# EAGLE schematic FPGA_board-v1 (EAGLE 9.5.2)
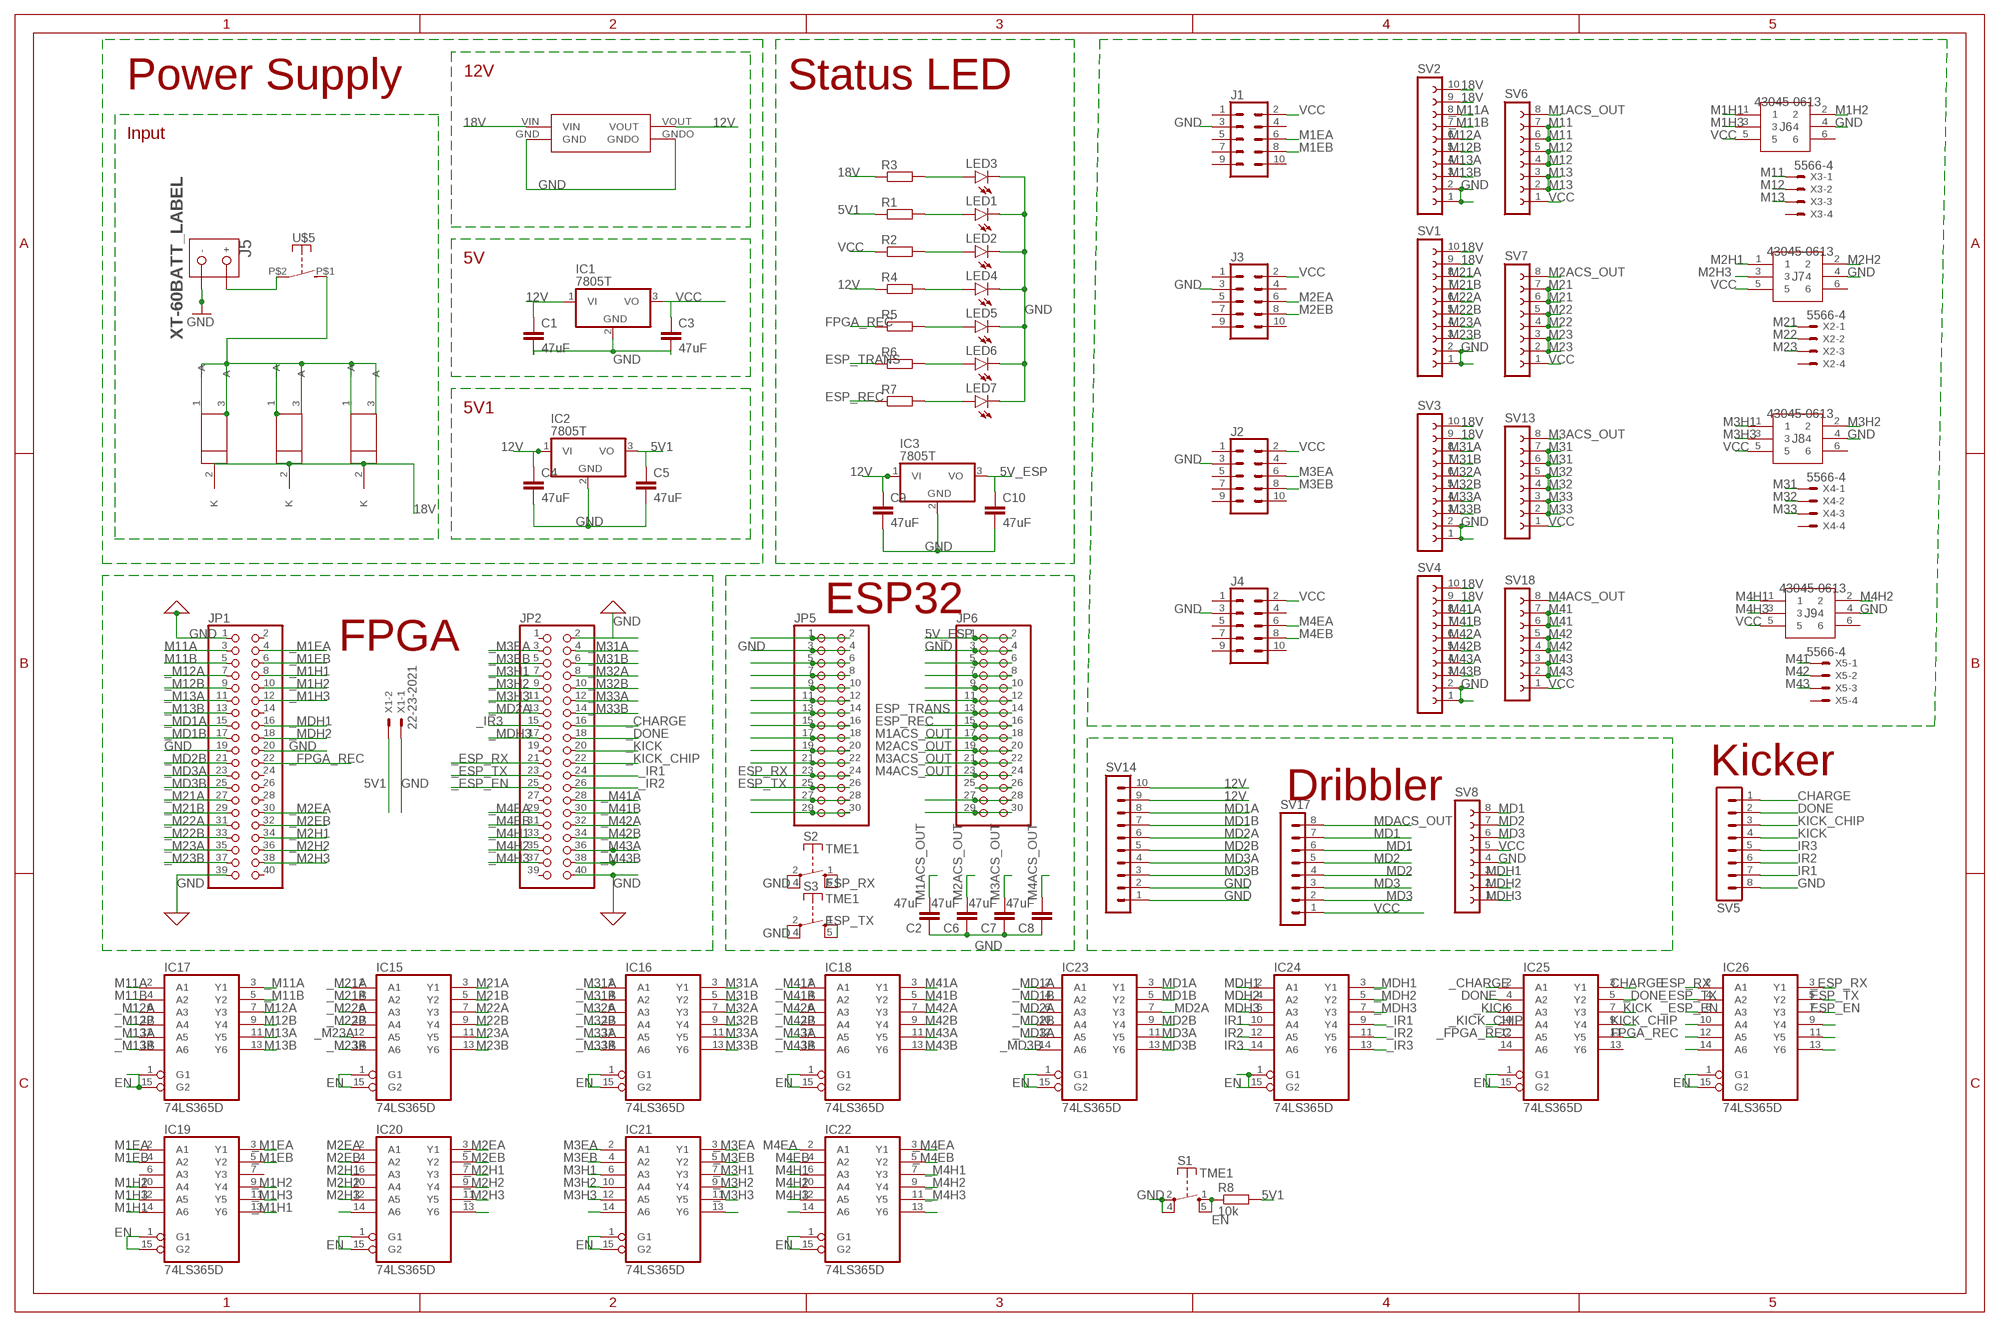
[diagram p0: schematic, sheet 1]

## Parts
C1  47uF  C-EUC1206  [C1206]
C2  47uF  C-EUC1206  [C1206]
C3  47uF  C-EUC1206  [C1206]
C4  47uF  C-EUC1206  [C1206]
C5  47uF  C-EUC1206  [C1206]
C6  47uF  C-EUC1206  [C1206]
C7  47uF  C-EUC1206  [C1206]
C8  47uF  C-EUC1206  [C1206]
C9  47uF  C-EUC1206  [C1206]
C10  47uF  C-EUC1206  [C1206]
IC1  7805T  [TO220H]
IC2  7805T  [TO220H]
IC3  7805T  [TO220H]
IC15  74LS365D  [SO16]
IC16  74LS365D  [SO16]
IC17  74LS365D  [SO16]
IC18  74LS365D  [SO16]
IC19  74LS365D  [SO16]
IC20  74LS365D  [SO16]
IC21  74LS365D  [SO16]
IC22  74LS365D  [SO16]
IC23  74LS365D  [SO16]
IC24  74LS365D  [SO16]
IC25  74LS365D  [SO16]
IC26  74LS365D  [SO16]
J1  CONN_05X2SHD_LOCK  [2X5-SHROUDED_LOCK]
J2  CONN_05X2SHD_LOCK  [2X5-SHROUDED_LOCK]
J3  CONN_05X2SHD_LOCK  [2X5-SHROUDED_LOCK]
J4  CONN_05X2SHD_LOCK  [2X5-SHROUDED_LOCK]
J5  XT-60BATT_LABEL  [XT-60]
J6  43045-0613  [43045-0613]
J7  43045-0613  [43045-0613]
J8  43045-0613  [43045-0613]
J9  43045-0613  [43045-0613]
JP1  PINHD-2X20  [2X20]
JP2  PINHD-2X20  [2X20]
JP5  PINHD-2X15  [2X15]
JP6  PINHD-2X15  [2X15]
LED1  LEDSMT1206  [1206]
LED2  LEDSMT1206  [1206]
LED3  LEDSMT1206  [1206]
LED4  LEDSMT1206  [1206]
LED5  LEDSMT1206  [1206]
LED6  LEDSMT1206  [1206]
LED7  LEDSMT1206  [1206]
R1  R-EU_R1206  [R1206]
R2  R-EU_R1206  [R1206]
R3  R-EU_R1206  [R1206]
R4  R-EU_R1206  [R1206]
R5  R-EU_R1206  [R1206]
R6  R-EU_R1206  [R1206]
R7  R-EU_R1206  [R1206]
R8  10k  R-EU_0204/7  [0204/7]
S1  TME1  [TME1]
S2  TME1  [TME1]
S3  TME1  [TME1]
SV1  FE10-1  [FE10]
SV2  FE10-1  [FE10]
SV3  FE10-1  [FE10]
SV4  FE10-1  [FE10]
SV5  MA08-1  [MA08-1]
SV6  FE08-1  [FE08]
SV7  FE08-1  [FE08]
SV8  FE08-1  [FE08]
SV13  FE08-1  [FE08]
SV14  MA10-1  [MA10-1]
SV17  MA08-1  [MA08-1]
SV18  FE08-1  [FE08]
U1  LP38690DT-3.3  [TO228P1042X238-3N]
U2  LP38690DT-3.3  [TO228P1042X238-3N]
U3  LP38690DT-3.3  [TO228P1042X238-3N]
U$4  BUCK  [BUCK]
U$5  SWITCH_DA10  [DA10]
X1  22-23-2021  [22-23-2021]
X2  5566-4  [5566-4]
X3  5566-4  [5566-4]
X4  5566-4  [5566-4]
X5  5566-4  [5566-4]

## Nets
5V1 [5v]: C5.1 IC2.3(VO) R1.1 R8.2 X1.2
5V_ESP [5v]: C10.1 IC3.3(VO) JP6.1 JP6.2
12V [18V]: C1.1 C4.1 C9.1 IC1.1(VI) IC2.1(VI) IC3.1(VI) R4.1 SV14.9 SV14.10 U$4.VOUT
18V [18V]: R3.1 SV1.9 SV1.10 SV2.9 SV2.10 SV3.9 SV3.10 SV4.9 SV4.10 U1.2(K) U2.2(K) U3.2(K) U$4.VIN
_CHARGE [signal]: IC25.2(A1) JP2.16
_DONE [signal]: IC25.5(Y2) JP2.18
_ESP_EN [signal]: IC26.6(A3) JP2.25
_ESP_RX [signal]: IC26.3(Y1) JP2.21
_ESP_TX [signal]: IC26.4(A2) JP2.23
_FPGA_REC [signal]: IC25.12(A5) JP1.22
_IR1 [signal]: IC24.9(Y4) JP2.24
_IR2 [signal]: IC24.11(Y5) JP2.26
_IR3 [signal]: IC24.13(Y6) JP2.15
_KICK [signal]: IC25.6(A3) JP2.20
_KICK_CHIP [signal]: IC25.10(A4) JP2.22
_M1EA [signal]: IC19.3(Y1) JP1.4
_M1EB [signal]: IC19.5(Y2) JP1.6
_M1H1 [signal]: IC19.13(Y6) JP1.8
_M1H2 [signal]: IC19.9(Y4) JP1.10
_M1H3 [signal]: IC19.11(Y5) JP1.12
_M2EA [signal]: IC20.3(Y1) JP1.30
_M2EB [signal]: IC20.5(Y2) JP1.32
_M2H1 [signal]: IC20.7(Y3) JP1.34
_M2H2 [signal]: IC20.9(Y4) JP1.36
_M2H3 [signal]: IC20.11(Y5) JP1.38
_M3EA [signal]: IC21.3(Y1) JP2.3
_M3EB [signal]: IC21.5(Y2) JP2.5
_M3H1 [signal]: IC21.7(Y3) JP2.7
_M3H2 [signal]: IC21.9(Y4) JP2.9
_M3H3 [signal]: IC21.11(Y5) JP2.11
_M4EA [signal]: IC22.3(Y1) JP2.29
_M4EB [signal]: IC22.5(Y2) JP2.31
_M4H1 [signal]: IC22.7(Y3) JP2.33
_M4H2 [signal]: IC22.9(Y4) JP2.35
_M4H3 [signal]: IC22.11(Y5) JP2.37
_M11A [signal]: IC17.3(Y1) SV2.8
_M11B [signal]: IC17.5(Y2) SV2.7
_M12A [signal]: IC17.6(A3) JP1.7
_M12B [signal]: IC17.10(A4) JP1.9
_M13A [signal]: IC17.12(A5) JP1.11
_M13B [signal]: IC17.14(A6) JP1.13
_M21A [signal]: IC15.2(A1) JP1.27
_M21B [signal]: IC15.4(A2) JP1.29
_M22A [signal]: IC15.6(A3) JP1.31
_M22B [signal]: IC15.10(A4) JP1.33
_M23A [signal]: IC15.12(A5) JP1.35
_M23B [signal]: IC15.14(A6) JP1.37
_M31A [signal]: IC16.2(A1) JP2.4
_M31B [signal]: IC16.4(A2) JP2.6
_M32A [signal]: IC16.6(A3) JP2.8
_M32B [signal]: IC16.10(A4) JP2.10
_M33A [signal]: IC16.12(A5) JP2.12
_M33B [signal]: IC16.14(A6) JP2.14
_M41A [signal]: IC18.2(A1) JP2.28
_M41B [signal]: IC18.4(A2) JP2.30
_M42A [signal]: IC18.6(A3) JP2.32
_M42B [signal]: IC18.10(A4) JP2.34
_M43A [signal]: IC18.12(A5) JP2.36
_M43B [signal]: IC18.14(A6) JP2.38
_MD1A [signal]: IC23.2(A1) JP1.15
_MD1B [signal]: IC23.4(A2) JP1.17
_MD2A [signal]: IC23.6(A3) JP2.13
_MD2B [signal]: IC23.10(A4) JP1.21
_MD3A [signal]: IC23.12(A5) JP1.23
_MD3B [signal]: IC23.14(A6) JP1.25
_MDH1 [signal]: IC24.3(Y1) JP1.16
_MDH2 [signal]: IC24.5(Y2) JP1.18
_MDH3 [signal]: IC24.7(Y3) JP2.17
CHARGE [signal]: IC25.3(Y1) SV5.1
DONE [signal]: IC25.4(A2) SV5.2
EN [signal]: IC15.1(G1) IC15.15(G2) IC16.1(G1) IC16.15(G2) IC17.1(G1) IC17.15(G2) IC18.1(G1) IC18.15(G2) IC19.1(G1) IC19.15(G2) IC20.1(G1) IC20.15(G2) IC21.1(G1) IC21.15(G2) IC22.1(G1) IC22.15(G2) IC23.1(G1) IC23.15(G2) IC24.1(G1) IC24.15(G2) IC25.1(G1) IC25.15(G2) IC26.1(G1) IC26.15(G2) R8.1 S1.1(S) S1.5(S)
ESP_EN [signal]: IC26.7(Y3)
ESP_REC [signal]: JP6.15 JP6.16 R7.1
ESP_RX [signal]: IC26.2(A1) JP5.23 JP5.24 S2.1(S) S2.5(S)
ESP_TRANS [signal]: JP6.13 JP6.14 R6.1
ESP_TX [signal]: IC26.5(Y2) JP5.25 JP5.26 S3.1(S) S3.5(S)
FPGA_REC [signal]: IC25.11(Y5) R5.1
GND [gnd]: C1.2 C2.1 C3.2 C4.2 C5.2 C6.1 C7.1 C8.1 C9.2 C10.2 IC1.2(GND) IC2.2(GND) IC3.2(GND) J1.3 J2.3 J3.3 J4.3 J5.GND(-) J6.4 J7.4 J8.4 J9.4 JP1.1 JP1.19 JP1.20 JP1.39 JP2.2 JP2.40 JP5.3 JP5.4 JP6.3 JP6.4 LED1.C LED2.C LED3.C LED4.C LED5.C LED6.C LED7.C S1.2(P) S1.4(P) S2.2(P) S2.4(P) S3.2(P) S3.4(P) SV1.1 SV1.2 SV2.1 SV2.2 SV3.1 SV3.2 SV4.1 SV4.2 SV5.8 SV8.4 SV14.1 SV14.2 U$4.GND U$4.GNDO X1.1
INPUT [VCKT]: U1.1(~A) U1.3(A) U2.1(~A) U2.3(A) U3.1(~A) U3.3(A) U$5.P$1(S)
IR1 [signal]: IC24.10(A4) SV5.7
IR2 [signal]: IC24.12(A5) SV5.6
IR3 [signal]: IC24.14(A6) SV5.5
KICK [signal]: IC25.7(Y3) SV5.4
KICK_CHIP [signal]: IC25.9(Y4) SV5.3
M1ACS_OUT [signal]: C2.2 JP6.17 JP6.18 SV6.8
M1EA [signal]: IC19.2(A1) J1.6
M1EB [signal]: IC19.4(A2) J1.8
M1H1 [signal]: IC19.14(A6) J6.1
M1H2 [signal]: IC19.10(A4) J6.2
M1H3 [signal]: IC19.12(A5) J6.3
M2ACS_OUT [signal]: C6.2 JP6.19 JP6.20 SV7.8
M2EA [signal]: IC20.2(A1) J3.6
M2EB [signal]: IC20.4(A2) J3.8
M2H1 [signal]: IC20.6(A3) J7.1
M2H2 [signal]: IC20.10(A4) J7.2
M2H3 [signal]: IC20.12(A5) J7.3
M3ACS_OUT [signal]: C7.2 JP6.21 JP6.22 SV13.8
M3EA [signal]: IC21.2(A1) J2.6
M3EB [signal]: IC21.4(A2) J2.8
M3H1 [signal]: IC21.6(A3) J8.1
M3H2 [signal]: IC21.10(A4) J8.2
M3H3 [signal]: IC21.12(A5) J8.3
M4ACS_OUT [signal]: C8.2 JP6.23 JP6.24 SV18.8
M4EA [signal]: IC22.2(A1) J4.6
M4EB [signal]: IC22.4(A2) J4.8
M4H1 [signal]: IC22.6(A3) J9.1
M4H2 [signal]: IC22.10(A4) J9.2
M4H3 [signal]: IC22.12(A5) J9.3
M11 [motor]: SV6.6 SV6.7 X3.1
M11A [signal]: IC17.2(A1) JP1.3
M11B [signal]: IC17.4(A2) JP1.5
M12 [motor]: SV6.4 SV6.5 X3.2
M12A [signal]: IC17.7(Y3) SV2.6
M12B [signal]: IC17.9(Y4) SV2.5
M13 [motor]: SV6.2 SV6.3 X3.3
M13A [signal]: IC17.11(Y5) SV2.4
M13B [signal]: IC17.13(Y6) SV2.3
M21 [motor]: SV7.6 SV7.7 X2.1
M21A [signal]: IC15.3(Y1) SV1.8
M21B [signal]: IC15.5(Y2) SV1.7
M22 [motor]: SV7.4 SV7.5 X2.2
M22A [signal]: IC15.7(Y3) SV1.6
M22B [signal]: IC15.9(Y4) SV1.5
M23 [motor]: SV7.2 SV7.3 X2.3
M23A [signal]: IC15.11(Y5) SV1.4
M23B [signal]: IC15.13(Y6) SV1.3
M31 [motor]: SV13.6 SV13.7 X4.1
M31A [signal]: IC16.3(Y1) SV3.8
M31B [signal]: IC16.5(Y2) SV3.7
M32 [motor]: SV13.4 SV13.5 X4.2
M32A [signal]: IC16.7(Y3) SV3.6
M32B [signal]: IC16.9(Y4) SV3.5
M33 [motor]: SV13.2 SV13.3 X4.3
M33A [signal]: IC16.11(Y5) SV3.4
M33B [signal]: IC16.13(Y6) SV3.3
M41 [motor]: SV18.6 SV18.7 X5.1
M41A [signal]: IC18.3(Y1) SV4.8
M41B [signal]: IC18.5(Y2) SV4.7
M42 [motor]: SV18.4 SV18.5 X5.2
M42A [signal]: IC18.7(Y3) SV4.6
M42B [signal]: IC18.9(Y4) SV4.5
M43 [motor]: SV18.2 SV18.3 X5.3
M43A [signal]: IC18.11(Y5) SV4.4
M43B [signal]: IC18.13(Y6) SV4.3
MD1 [motor]: SV8.8 SV17.6 SV17.7
MD1A [signal]: IC23.3(Y1) SV14.8
MD1B [signal]: IC23.5(Y2) SV14.7
MD2 [motor]: SV8.7 SV17.4 SV17.5
MD2A [signal]: IC23.7(Y3) SV14.6
MD2B [signal]: IC23.9(Y4) SV14.5
MD3 [motor]: SV8.6 SV17.2 SV17.3
MD3A [signal]: IC23.11(Y5) SV14.4
MD3B [signal]: IC23.13(Y6) SV14.3
MDACS_OUT: SV17.8
MDH1 [signal]: IC24.2(A1) SV8.3
MDH2 [signal]: IC24.4(A2) SV8.2
MDH3 [signal]: IC24.6(A3) SV8.1
N$1: JP5.1 JP5.2
N$4: LED1.A R1.2
N$6: JP5.5 JP5.6
N$7: LED2.A R2.2
N$8: JP5.7 JP5.8
N$9: JP5.9 JP5.10
N$10: LED3.A R3.2
N$11: JP5.11 JP5.12
N$12: JP5.13 JP5.14
N$13: LED4.A R4.2
N$14: JP5.15 JP5.16
N$15: JP5.17 JP5.18
N$16: LED5.A R5.2
N$17: JP5.19 JP5.20
N$18: JP5.21 JP5.22
N$19: LED6.A R6.2
N$22: LED7.A R7.2
N$23: JP5.27 JP5.28
N$24: JP5.29 JP5.30
N$27: JP6.5 JP6.6
N$28: JP6.7 JP6.8
N$29: JP6.9 JP6.10
N$30: JP6.11 JP6.12
N$38: JP6.27 JP6.28
N$39: JP6.29 JP6.30
N$41: JP6.25 JP6.26
N$99: IC20.14(A6)
N$123: IC20.13(Y6)
N$143: IC21.14(A6)
N$165: IC21.13(Y6)
N$191: IC22.13(Y6)
N$197: IC22.14(A6)
N$203: IC26.10(A4)
N$204: IC26.12(A5)
N$205: IC26.14(A6)
N$209: IC26.9(Y4)
N$210: IC26.11(Y5)
N$211: IC26.13(Y6)
SUPP [VCKT]: J5.BATT(+) U$5.P$2(P)
VCC: C3.1 IC1.3(VO) J1.2 J2.2 J3.2 J4.2 J6.5 J7.5 J8.5 J9.5 R2.1 SV6.1 SV7.1 SV8.5 SV13.1 SV17.1 SV18.1
Unconnected: IC19.6(A3) IC19.7(Y3) IC25.13(Y6) IC25.14(A6) J1.1 J1.4 J1.5 J1.7 J1.9 J1.10 J2.1 J2.4 J2.5 J2.7 J2.9 J2.10 J3.1 J3.4 J3.5 J3.7 J3.9 J3.10 J4.1 J4.4 J4.5 J4.7 J4.9 J4.10 J6.6 J7.6 J8.6 J9.6 JP1.2 JP1.14 JP1.24 JP1.26 JP1.28 JP1.40 JP2.1 JP2.19 JP2.27 JP2.39 X2.4 X3.4 X4.4 X5.4

## Notes on the sheet
- 12V
- Power Supply | Status LED
- Input
- 5V
- 5V1
- ESP32
- FPGA
- Kicker
- Dribbler

## Power pins joined to a net without a drawn wire
GND: IC15.8(GND) IC16.8(GND) IC17.8(GND) IC18.8(GND) IC19.8(GND) IC20.8(GND) IC21.8(GND) IC22.8(GND) IC23.8(GND) IC24.8(GND) IC25.8(GND) IC26.8(GND)
VCC: IC15.16(VCC) IC16.16(VCC) IC17.16(VCC) IC18.16(VCC) IC19.16(VCC) IC20.16(VCC) IC21.16(VCC) IC22.16(VCC) IC23.16(VCC) IC24.16(VCC) IC25.16(VCC) IC26.16(VCC)

## Library data of the parts
C1-C10 = rcl:C-EU: CAPACITOR, European symbol
IC1-IC3 = linear:78*: Positive VOLTAGE REGULATOR Source: http://cache.national.com/ds/LM/LM78L05.pdf http://www.fairchildsemi.com/ds/LM/LM7805.pdf
IC15-IC26 = 74xx-us:74*365: Hex BUS DRIVER, 3-state
J1-J4 = SparkFun-Connectors:CONN_05X2: Multi connection point. Often used as Generic Header-pin footprint for 0.1 inch spaced/style header connections For AVR SPI programming port, see special device with nice symbol: "AVR_SPI_PROG_5x2.dev" You can populate with any combo of single row headers, but if you'd like an exact match, check these: 2x5 AVR ICSP Male Header <https://www.sparkfun.com/products/778> (PRT-00778) 2x5 Pin Shrouded Header <https://www.sparkfun.com/products/8506> (PRT-08506) On any of the 0.1 inch spaced packages, you can populate with these: Break Away Headers - Straight <https://www.sparkfun.com/products/116> (PRT-00116) Break Away Male Headers - Right Angle <https://www.sparkfun.com/products/553> (PRT-00553) Female Headers <https://www.sparkfun.com/products/115> (PRT-00115) Break Away Headers - Machine Pin <https://www.sparkfun.com/products/117> (PRT-00117) Break Away Female Headers - Swiss Machine Pin <https://www.sparkfun.com/products/743> (PRT-00743) Special note: the shrouded connector mates well with our 5x2 ribbon cables: 2x5 Pin IDC Ribbon Cable <https://www.sparkfun.com/products/8535> (PRT-08535); PROD_ID: CONN-08671; SF_ID: PRT-08506
J5 = RoboJackets-Connectors:XT-60: XT-60 Power Connector Distributor: HobbyKing <http://www.hobbyking.com/hobbyking/store/RC_PRODUCT_SEARCH.asp?strSearch=xt-60>
J6-J9 = 43045-0613:43045-0613: Header 3.00mm, WTB, dual row, vert,6w Molex MICRO-FIT 3.0 Series, Series Number 43045, 3mm Pitch 6 Way 2 Row Straight PCB Header, Solder Termination, 5A Source: Datasheet <http://uk.rs-online.com/webdocs/150e/0900766b8150e466.pdf>; ALLIED_NUMBER: 70090681; ALLIED_PRICE-STOCK: http://www.alliedelec.com/molex-incorporated-43045-0613/70090681/; DESCRIPTION: Header 3.00mm, WTB, dual row, vert,6w Molex MICRO-FIT 3.0 Series, Series Number 43045, 3mm Pitch 6 Way 2 Row Straight PCB Header, Solder Termination, 5A; HEIGHT: mm; MANUFACTURER_NAME: Molex; MANUFACTURER_PART_NUMBER: 43045-0613; MOUSER_PART_NUMBER: 538-43045-0613; MOUSER_PRICE-STOCK: https://www.mouser.com/Search/Refine.aspx?Keyword=538-43045-0613; RS_PART_NUMBER: 6700377P; RS_PRICE-STOCK: http://uk.rs-online.com/web/p/products/6700377P
JP1 JP2 = pinhead:PINHD-2X20: PIN HEADER
JP5 JP6 = pinhead:PINHD-2X15: PIN HEADER
LED1-LED7 = led:LED: LED OSRAM: - CHIPLED LG R971, LG N971, LY N971, LG Q971, LY Q971, LO R971, LY R971 LH N974, LH R974 LS Q976, LO Q976, LY Q976 LO Q996 - Hyper CHIPLED LW Q18S LB Q993, LB Q99A, LB R99A - SideLED LS A670, LO A670, LY A670, LG A670, LP A670 LB A673, LV A673, LT A673, LW A673 LH A674 LY A675 LS A676, LA A676, LO A676, LY A676, LW A676 LS A679, LY A679, LG A679 - Hyper Micro SIDELED® LS Y876, LA Y876, LO Y876, LY Y876 LT Y87S - SmartLED LW L88C, LW L88S LB L89C, LB L89S, LG L890 LS L89K, LO L89K, LY L89K LS L896, LA L896, LO L896, LY L896 - TOPLED LS T670, LO T670, LY T670, LG T670, LP T670 LSG T670, LSP T670, LSY T670, LOP T670, LYG T670 LG T671, LOG T671, LSG T671 LB T673, LV T673, LT T673, LW T673 LH T674 LS T676, LA T676, LO T676, LY T676, LB T676, LH T676, LSB T676, LW T676 LB T67C, LV T67C, LT T67C, LS T67K, LO T67K, LY T67K, LW E67C LS E67B, LA E67B, LO E67B, LY E67B, LB E67C, LV E67C, LT E67C LW T67C LS T679, LY T679, LG T679 LS T770, LO T770, LY T770, LG T770, LP T770 LB T773, LV T773, LT T773, LW T773 LH T774 LS E675, LA E675, LY E675, LS T675 LS T776, LA T776, LO T776, LY T776, LB T776 LHGB T686 LT T68C, LB T68C - Hyper Mini TOPLED® LB M676 - Mini TOPLED Santana® LG M470 LS M47K, LO M47K, LY M47K Source: http://www.osram.convergy.de LUXEON: - LUMILED® LXK2-PW12-R00, LXK2-PW12-S00, LXK2-PW14-U00, LXK2-PW14-V00 LXK2-PM12-R00, LXK2-PM12-S00, LXK2-PM14-U00 LXK2-PE12-Q00, LXK2-PE12-R00, LXK2-PE12-S00, LXK2-PE14-T00, LXK2-PE14-U00 LXK2-PB12-K00, LXK2-PB12-L00, LXK2-PB12-M00, LXK2-PB14-N00, LXK2-PB14-P00, LXK2-PB14-Q00 LXK2-PR12-L00, LXK2-PR12-M00, LXK2-PR14-Q00, LXK2-PR14-R00 LXK2-PD12-Q00, LXK2-PD12-R00, LXK2-PD12-S00 LXK2-PH12-R00, LXK2-PH12-S00 LXK2-PL12-P00, LXK2-PL12-Q00, LXK2-PL12-R00 Source: www.luxeon.com KINGBRIGHT: KA-3528ASYC Source: www.kingbright.com
R1-R8 = resistor:R-EU_: RESISTOR, European symbol
S1-S3 = switch-misc:TME1: SWITCH
SV1-SV4 = con-lsta:FE10-1: FEMALE HEADER; OC_FARNELL: unknown; OC_NEWARK: unknown
SV5 SV17 = con-lstb:MA08-1: PIN HEADER; OC_FARNELL: unknown; OC_NEWARK: unknown
SV6-SV8 SV13 SV18 = con-lsta:FE08-1: FEMALE HEADER; OC_FARNELL: unknown; OC_NEWARK: unknown
SV14 = con-lstb:MA10-1: PIN HEADER; OC_FARNELL: unknown; OC_NEWARK: unknown
U1-U3 = LP38690DT-3.3:LP38690DT-3.3; MPN: LP38690DT-3.3; OC_FARNELL: 1008048; OC_NEWARK: 41K7439; PACKAGE: TO-252; SUPPLIER: National Semiconductor
U$4 = BUCK:BUCK
U$5 = switch_DA10:SWITCH_DA10
X1 = con-molex:22-23-2021: .100" (2.54mm) Center Header - 2 Pin; MF: MOLEX; MPN: 22-23-2021; OC_FARNELL: 1462926; OC_NEWARK: 25C3832
X2-X5 = con-molex:5566-4: Mini FIT connector 4 pol Source: http://www.molex.com; MF: MOLEX; OC_FARNELL: unknown; OC_NEWARK: unknown

## Net classes
0 signal1: width 0.3 mm, drill 0.4 mm, clearance 0.2 mm
1 5v: width 0.4 mm, drill 0.4 mm, clearance 0.2 mm
2 18V: width 1.2 mm, drill 1.3 mm, clearance 0.2 mm
3 signal: width 0.3 mm, drill 0.4 mm, clearance 0.2 mm
4 gnd: width 0.3 mm, drill 0.4 mm, clearance 0.2 mm
5 VCKT: width 4 mm, drill 4 mm, clearance 0.2 mm
6 motor: width 0.8 mm, drill 1 mm, clearance 0.2 mm